# Altium project percepcao_externa_official.PrjPcb
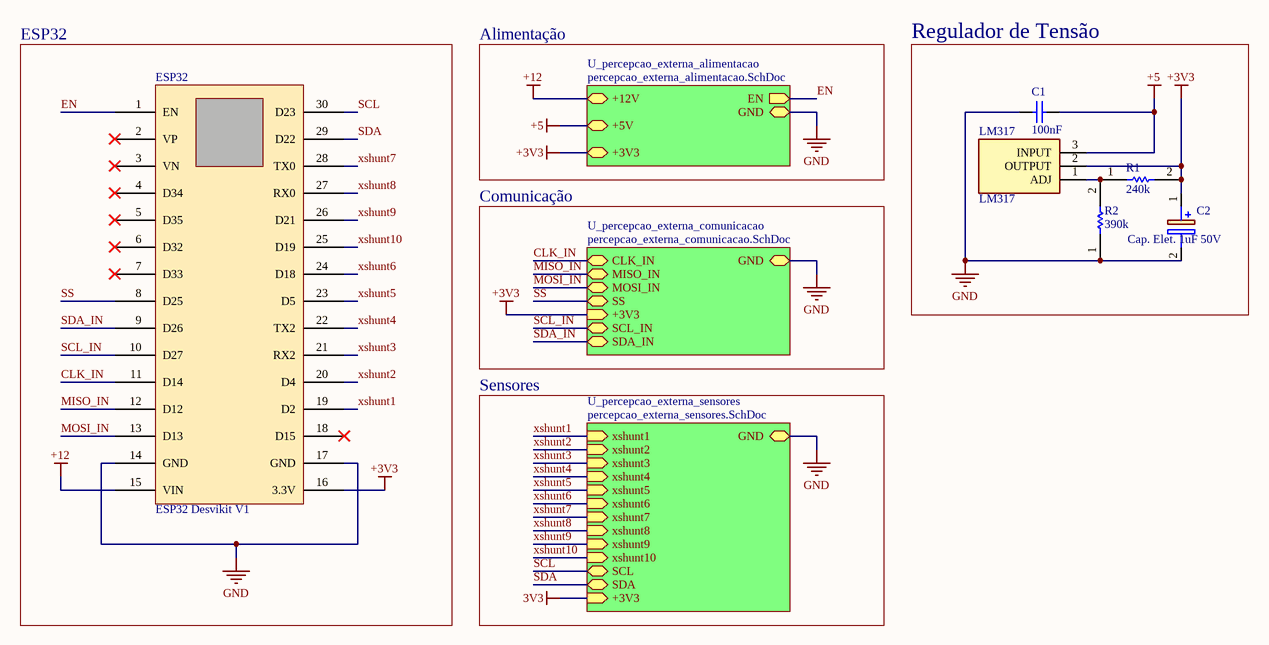
[diagram p0: percepcao_externa_official.SchDoc]
4 sheets, 30 parts. Net scope: hierarchical (ports join the sheet entries above them; power ports are global).
Board file: percepcao_externa_official.PcbDoc
Sheets:
  percepcao_externa_official.SchDoc
    U_percepcao_externa_alimentacao = percepcao_externa_alimentacao.SchDoc
    U_percepcao_externa_sensores = percepcao_externa_sensores.SchDoc
    U_percepcao_externa_comunicacao = percepcao_externa_comunicacao.SchDoc

## Sheet percepcao_externa_official.SchDoc
size A4; SheetNumber: 1; SheetTotal: 4

### Parts
C1  100nF  [CAP CER DISK 10uF 50V]
C2  Cap. Elet. 1uF 50V  [Cap. Elet. 470uF 16V]
ESP32  value ESP32 Desvikit V1  [ESP32_Desvikit_v1]  (hidden comment: microcontrolador)
LM317  LM317  [TO254P467X1016X1971-3P]
R1  240k  [RESC3216X60N]
R2  390k  [RESC3216X60N]

### Blocks framed on the sheet
ESP32: ESP32
Regulador de Tensão: C1 C2 LM317 R1 R2

### Sub-sheets
U_percepcao_externa_alimentacao = percepcao_externa_alimentacao.SchDoc: EN (out), GND (bidir), +12V (bidir), +5V (bidir), +3V3 (bidir)
U_percepcao_externa_comunicacao = percepcao_externa_comunicacao.SchDoc: CLK_IN (bidir), MISO_IN (bidir), MOSI_IN (bidir), SS (bidir), GND (bidir), +3V3 (in), SCL_IN (bidir), SDA_IN (bidir)
U_percepcao_externa_sensores = percepcao_externa_sensores.SchDoc: xshunt1 (in), xshunt2 (in), xshunt3 (in), xshunt4 (in), xshunt5 (in), xshunt6 (in), xshunt7 (in), xshunt8 (in), xshunt9 (in), xshunt10 (in), SCL (bidir), SDA (bidir), GND (bidir), +3V3 (in)

### Nets
3V3: sheet U_percepcao_externa_sensores/+3V3
+3V3: C2.1(+) ESP32.16(3.3V) LM317.2(OUTPUT) R1.2 ; sheet U_percepcao_externa_alimentacao/+3V3, sheet U_percepcao_externa_comunicacao/+3V3
+5: C1.2 LM317.3(INPUT) ; sheet U_percepcao_externa_alimentacao/+5V  [project net +5V]
+12: ESP32.15(VIN) ; sheet U_percepcao_externa_alimentacao/+12V  [project net +12V]
GND: C1.1 C2.2(-) ESP32.14(GND) ESP32.17(GND) R2.1 ; sheet U_percepcao_externa_alimentacao/GND, sheet U_percepcao_externa_sensores/GND, sheet U_percepcao_externa_comunicacao/GND
CLK_IN: ESP32.11(D14) ; sheet U_percepcao_externa_comunicacao/CLK_IN
EN: ESP32.1(EN) ; sheet U_percepcao_externa_alimentacao/EN
MISO_IN: ESP32.12(D12) ; sheet U_percepcao_externa_comunicacao/MISO_IN
MOSI_IN: ESP32.13(D13) ; sheet U_percepcao_externa_comunicacao/MOSI_IN
SCL: ESP32.30(D23) ; sheet U_percepcao_externa_sensores/SCL
SCL_IN: ESP32.10(D27) ; sheet U_percepcao_externa_comunicacao/SCL_IN
SDA: ESP32.29(D22) ; sheet U_percepcao_externa_sensores/SDA
SDA_IN: ESP32.9(D26) ; sheet U_percepcao_externa_comunicacao/SDA_IN
SS: ESP32.8(D25) ; sheet U_percepcao_externa_comunicacao/SS
xshunt1: ESP32.19(D2) ; sheet U_percepcao_externa_sensores/xshunt1
xshunt2: ESP32.20(D4) ; sheet U_percepcao_externa_sensores/xshunt2
xshunt3: ESP32.21(RX2) ; sheet U_percepcao_externa_sensores/xshunt3
xshunt4: ESP32.22(TX2) ; sheet U_percepcao_externa_sensores/xshunt4
xshunt5: ESP32.23(D5) ; sheet U_percepcao_externa_sensores/xshunt5
xshunt6: ESP32.24(D18) ; sheet U_percepcao_externa_sensores/xshunt6
xshunt7: ESP32.28(TX0) ; sheet U_percepcao_externa_sensores/xshunt7
xshunt8: ESP32.27(RX0) ; sheet U_percepcao_externa_sensores/xshunt8
xshunt9: ESP32.26(D21) ; sheet U_percepcao_externa_sensores/xshunt9
xshunt10: ESP32.25(D19) ; sheet U_percepcao_externa_sensores/xshunt10
NetLM317_1: LM317.1(ADJ) R1.1 R2.2

Not connected (* = marked no-connect by the designer): ESP32 2(VP)* 3(VN)* 4(D34)* 5(D35)* 6(D32)* 7(D33)* 18(D15)*

### Notes on the sheet
- Alimentação
- Comunicação
- Sensores

### Library data of the parts
C1 = CAP CER DISK 10uF 50V_1: CAP CER DISK 10uF 50V; Manufacturer Part Number: IMP14925; Product Range: MCFY Series; Capacitance: 0.1uF; Capacitance Tolerance: +80%, -20%; Dielectric Characteristic: Y5; Voltage Rating: 50; Capacitor Terminals: Radial Leaded; SVHC: No SVHC (15-Jun-2015); Supplier 1: Mult Comercial; Manufacturer: -; RoHS: YES; Stock 1: 115809; Pricing 1: 1=0.10 (BRL); Packaging: Each; Lead Spacing: 5; Operating Temperature Min: -25; Operating Temperature Max: 85; Capacitance Tolerance ±: +80%, -20%; Operating Temperature Range: -25°C to +85°C<!--FANDB--><div class="features-and-benefits-container"><div class="features-and-benefits-description"><span class="features-benefits-value">The MCFY series from Multicomp are radial leaded ceramic disc capacitors. The capacitance values ranges from 6800pF to 0.22?F.</span></div><div class="features-and-benefits-list"><ul class="features-and-benefits-list-list"><li class="features-and-benefits-list-item">Large capacitance in small size</li><li class="features-and-benefits-list-item">Rated voltage of 50V</li><li class="features-and-benefits-list-item">80%/-20% tolerance</li><li class="features-and-benefits-list-item">Operating temperature range -25°C to +85; ComponentLink1URL: http://loja.multcomercial.com.br/capacitor-ceramico-disco-100kpf-50v-104-100k-100nf-0-1uf-cod-1351.html; ComponentLink1Description: http://loja.multcomercial.com.br/capacitor-ceramico-disco-100kpf-50v-104-100k-100nf-0-1uf-cod-1351.html; Supplier Part Number 1: Capacitor Cerâmico Disco 100Kpf/50V (104/100K/100nF/0.1uF) cód. 1351
C2 = Cap. Elet. 470 uF 16V: Aluminum Organic Polymer Capacitors 16volts 470uF ESR 10mohm; Manufacturer_Name: Panasonic; Manufacturer_Part_Number: 16SEPC470M; Datasheet Link: http://industrial.panasonic.com/www-cgi/jvcr13pz.cgi?E+CI+4+AAB8010+16SEPC470M+8+WW; Height: 13mm; Mouser Part Number: 667-16SEPC470M; Mouser Price/Stock: https://www.mouser.co.uk/ProductDetail/Panasonic/16SEPC470M?qs=OE1iw1LrrPEdZuWyF2l%252B5w%3D%3D; Arrow Part Number: 16SEPC470M; Arrow Price/Stock: https://www.arrow.com/en/products/16sepc470m/panasonic
ESP32 = ESP32 Desvikit v1: microcontrolador com moculo bluethoth e wifi
LM317 = LM317: Integrated Circuit; Manufacturer_Name: Changjiang Electronics Tech (CJ); Datasheet Link: https://datasheet.lcsc.com/szlcsc/Changjiang-Electronics-Tech-CJ-LM317_C22147.pdf; Height: 4.67mm; Manufacturer_Part_Number: LM317
R1 R2 = RES 1206: RES 1206 5%; Manufacturer_Name: Vishay; Manufacturer_Part_Number: CRCW12064K70FKEA; Datasheet Link: http://docs-emea.rs-online.com/webdocs/13ec/0900766b813ecc08.pdf; Height: 0.6mm; Mouser Part Number: 71-CRCW1206-4.7K-E3; Mouser Price/Stock: https://www.mouser.co.uk/ProductDetail/Vishay-Dale/CRCW12064K70FKEA?qs=1vm4qhDHCvlKJmatsKzyFQ%3D%3D; Arrow Part Number: CRCW12064K70FKEA; Arrow Price/Stock: https://www.arrow.com/en/products/crcw12064k70fkea/vishay

## Sheet percepcao_externa_alimentacao.SchDoc
size A4; SheetNumber: 2; SheetTotal: 4
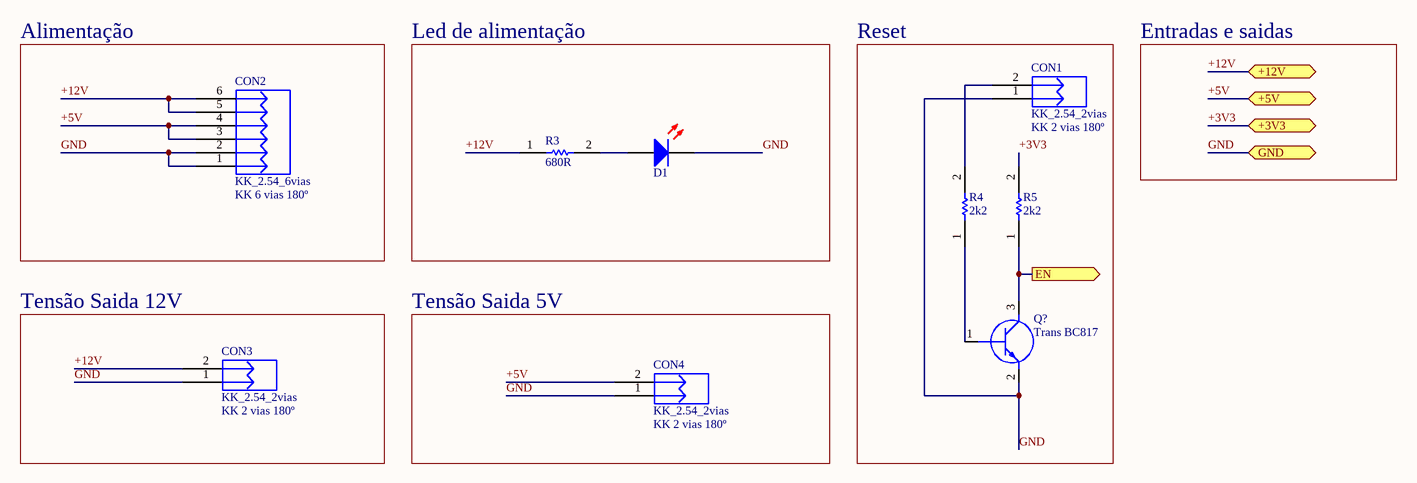
[diagram p1: percepcao_externa_alimentacao.SchDoc]

### Parts
BC817  Trans BC817  [SOT96P240X110-3N]
CON1  KK_2.54_2vias  Valor: KK 2 vias 180º  [KK_2VIAS_180º]
CON2  KK_2.54_6vias  Valor: KK 6 vias 180º  [KK_6vias_180°]
CON3  KK_2.54_2vias  Valor: KK 2 vias 180º  [KK_2VIAS_180º]
CON4  KK_2.54_2vias  Valor: KK 2 vias 180º  [KK_2VIAS_180º]
D1  LED 5MM RED  [LED 5MM RED]  (value not drawn)
R3  680R  [RESC3216X60N]
R4  2k2  [RESC3216X60N]
R5  2k2  [RESC3216X60N]

### Blocks framed on the sheet
Alimentação: CON2
Led de alimentação: D1 R3
Reset: BC817 CON1 R4 R5
Tensão Saida 12V: CON3
Tensão Saida 5V: CON4

### Ports
+3V3 (bidir), +5V (bidir), +12V (bidir), EN (out), GND (bidir)

### Nets
+3V3: R5.2 ; port +3V3
+5V: CON2.3 CON2.4 CON4.2 ; port +5V
+12V: CON2.5 CON2.6 CON3.2 R3.1 ; port +12V
GND: BC817.2(E) CON1.1 CON2.1 CON2.2 CON3.1 CON4.1 D1.2(K) ; port GND
EN: BC817.3(C) R5.1 ; port EN
NetBC817_1: BC817.1(B) R4.1
NetCON1_2: CON1.2 R4.2
NetD1_1: D1.1(A) R3.2

### Notes on the sheet
- Entradas e saidas

### Library data of the parts
BC817 = Trans BC817: Transistor BJT NPN BC817-25-7-F; Manufacturer_Name: Diodes Inc.
CON1 CON3 CON4 = KK_2.54_2vias: Conector KK 2.54mm 2 vias; Descrição: Conector KK 3 vias com passo 2.54mm; Encapsulamento: PTH - 180º; Modelo: 2 vias - 180º; Marca: *; Observação: *
CON2 = KK_2.54_6vias: Conector KK 2.54mm 6 vias; Descrição: Conector KK 3 vias com passo 2.54mm; Encapsulamento: PTH - 180º; Modelo: 3 vias - 180º; Marca: *; Observação: *
D1 = LED 5MM RED: Manufacturer: Paralight; Manufacturer Part Number: IMP585; Bulb Size: 3mm; Wavelength Typ: 625; Forward Voltage: 2; Forward Current If: 20; Luminous Intensity: 3; LED Mounting: Through Hole; Lens Shape: Round; Viewing Angle: 60°; SVHC: No SVHC (15-Jun-2015); External Diameter: 2.9; External Length / Height: 4.6; Forward Voltage VF Max: 2.5; LED / Lamp Size: 3mm / T-1; LED Type: Standard; Lead Cross-section Depth: 0.5; Luminous Intensity @ If Min: 0.7; PIV Max: 5; Peak Forward Current: 7; Voltage Vf Typ: 2.2V<!--FANDB--><div class="features-and-benefits-container"><div class="features-and-benefits-description"><span class="features-benefits-value">The L-934LID from Kingbright is a through hole round shape high efficiency red colour LED. The device is made of gallium arsenide phosphide on gallium phosphide orange light emitting diode. This LED is widely used because of low power consumption, long life and solid state reliability.</span></div><div class="features-and-benefits-list"><ul class="features-and-benefits-list-list"><li class="features-and-benefits-list-item">Standard bulb size of T-1 (3mm)</li><li class="features-and-benefits-list-item">Reliable and rugged</li><li class="features-and-benefits-list-item">Viewing angle is 60°</li><li class="features-and-benefits-list-item">Luminous intensity of 3mcd at 2mA</li><li class="features-and-benefits-list-item">Forward voltage is 2.0V</li><li class="features-and-benefits-list-item">Forward current (If) is 20mA</li><li class="features-and-benefits-list-item">Dominant wavelength is 625nm at IF=20mA</li><li class="features-and-benefits-list-item">Peak wavelength is 627nm at IF=20; Supplier 1: Mult Comercial; RoHS: YES; Stock 1: 35260; Pricing 1: 1=0.15 (BRL); LED Colour: Red; Packaging: Each; MSL: -; Current If Luminous Intensity: 2; Dominant Wavelength: 625; Forward Current If Max: 20; Lead Cross-section Width: 0.5; Lead Spacing: 2.54; Luminous Intensity Typ: 3; Mounting Type: PCB Through Hole; No. of Pins: 2; Operating Temperature Max: 85; Operating Temperature Min: -40; Operating Temperature Range: -40°C to +85; Peak Wavelength: 625; ComponentLink1URL: http://loja.multcomercial.com.br/led-3mm-vermelho-difuso-l-314hd-paralight.html; ComponentLink1Description: http://loja.multcomercial.com.br/led-3mm-vermelho-difuso-l-314hd-paralight.html; Supplier Part Number 1: Led 3mm Vermelho Difuso L-314HD - Paralight
R3-R5 = Resistor 1206: Resistor; Manufacturer_Name: Vishay; Manufacturer_Part_Number: CRCW12064K70FKEA; Datasheet Link: http://docs-emea.rs-online.com/webdocs/13ec/0900766b813ecc08.pdf; Height: 0.6mm; Mouser Part Number: 71-CRCW1206-4.7K-E3; Mouser Price/Stock: https://www.mouser.co.uk/ProductDetail/Vishay-Dale/CRCW12064K70FKEA?qs=1vm4qhDHCvlKJmatsKzyFQ%3D%3D; Arrow Part Number: CRCW12064K70FKEA; Arrow Price/Stock: https://www.arrow.com/en/products/crcw12064k70fkea/vishay

## Sheet percepcao_externa_sensores.SchDoc
size A4; SheetNumber: 4; SheetTotal: 4
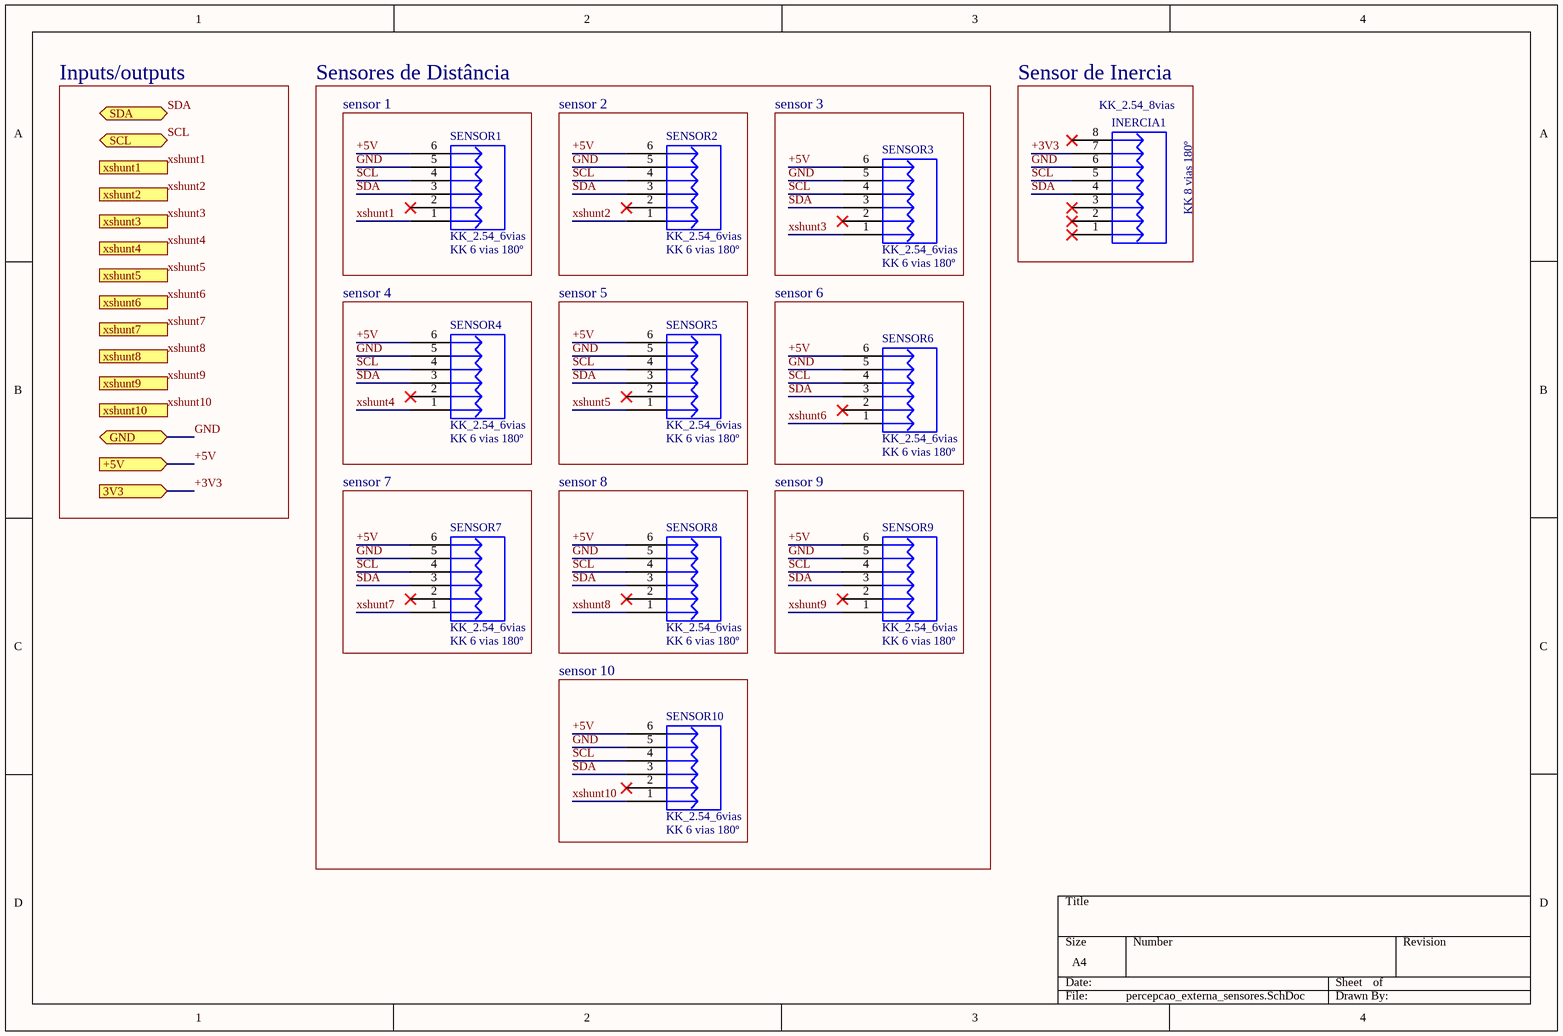
[diagram p2: percepcao_externa_sensores.SchDoc]

### Parts
INERCIA1  KK_2.54_8vias  Valor: KK 8 vias 180º  [KK_8vias_180°]
SENSOR1  KK_2.54_6vias  Valor: KK 6 vias 180º  [KK_6vias_180°]
SENSOR2  KK_2.54_6vias  Valor: KK 6 vias 180º  [KK_6vias_180°]
SENSOR3  KK_2.54_6vias  Valor: KK 6 vias 180º  [KK_6vias_180°]
SENSOR4  KK_2.54_6vias  Valor: KK 6 vias 180º  [KK_6vias_180°]
SENSOR5  KK_2.54_6vias  Valor: KK 6 vias 180º  [KK_6vias_180°]
SENSOR6  KK_2.54_6vias  Valor: KK 6 vias 180º  [KK_6vias_180°]
SENSOR7  KK_2.54_6vias  Valor: KK 6 vias 180º  [KK_6vias_180°]
SENSOR8  KK_2.54_6vias  Valor: KK 6 vias 180º  [KK_6vias_180°]
SENSOR9  KK_2.54_6vias  Valor: KK 6 vias 180º  [KK_6vias_180°]
SENSOR10  KK_2.54_6vias  Valor: KK 6 vias 180º  [KK_6vias_180°]

### Blocks framed on the sheet
Sensor de Inercia: INERCIA1
sensor 1: SENSOR1
sensor 2: SENSOR2
sensor 3: SENSOR3
sensor 4: SENSOR4
sensor 5: SENSOR5
sensor 6: SENSOR6
sensor 7: SENSOR7
sensor 8: SENSOR8
sensor 9: SENSOR9
sensor 10: SENSOR10

### Ports
3V3 (in), +5V (in), GND (bidir), SCL (bidir), SDA (bidir), xshunt1 (in), xshunt2 (in), xshunt3 (in), xshunt4 (in), xshunt5 (in), xshunt6 (in), xshunt7 (in), xshunt8 (in), xshunt9 (in), xshunt10 (in)

### Nets
GND: INERCIA1.6 SENSOR1.5 SENSOR2.5 SENSOR3.5 SENSOR4.5 SENSOR5.5 SENSOR6.5 SENSOR7.5 SENSOR8.5 SENSOR9.5 SENSOR10.5 ; port GND
+3V3: INERCIA1.7 ; port 3V3
+5V: SENSOR1.6 SENSOR2.6 SENSOR3.6 SENSOR4.6 SENSOR5.6 SENSOR6.6 SENSOR7.6 SENSOR8.6 SENSOR9.6 SENSOR10.6 ; port +5V
SCL: INERCIA1.5 SENSOR1.4 SENSOR2.4 SENSOR3.4 SENSOR4.4 SENSOR5.4 SENSOR6.4 SENSOR7.4 SENSOR8.4 SENSOR9.4 SENSOR10.4 ; port SCL
SDA: INERCIA1.4 SENSOR1.3 SENSOR2.3 SENSOR3.3 SENSOR4.3 SENSOR5.3 SENSOR6.3 SENSOR7.3 SENSOR8.3 SENSOR9.3 SENSOR10.3 ; port SDA
xshunt1: SENSOR1.1 ; port xshunt1
xshunt2: SENSOR2.1 ; port xshunt2
xshunt3: SENSOR3.1 ; port xshunt3
xshunt4: SENSOR4.1 ; port xshunt4
xshunt5: SENSOR5.1 ; port xshunt5
xshunt6: SENSOR6.1 ; port xshunt6
xshunt7: SENSOR7.1 ; port xshunt7
xshunt8: SENSOR8.1 ; port xshunt8
xshunt9: SENSOR9.1 ; port xshunt9
xshunt10: SENSOR10.1 ; port xshunt10

Not connected (* = marked no-connect by the designer): INERCIA1 1* 2* 3* 8*; SENSOR1 2*; SENSOR2 2*; SENSOR3 2*; SENSOR4 2*; SENSOR5 2*; SENSOR6 2*; SENSOR7 2*; SENSOR8 2*; SENSOR9 2*; SENSOR10 2*

### Notes on the sheet
- Inputs/outputs
- Sensores de Distância

### Library data of the parts
INERCIA1 = KK_2.54_8vias: Conector KK 2.54mm 8 vias; Descrição: Conector KK 3 vias com passo 2.54mm; Encapsulamento: PTH - 180º; Modelo: 3 vias - 180º; Marca: *; Observação: *
SENSOR1-SENSOR10 = KK_2.54_6vias: as CON2 on sheet percepcao_externa_alimentacao; Marca: *; Observação: *

## Sheet percepcao_externa_comunicacao.SchDoc
size A4; SheetNumber: 4; SheetTotal: 4
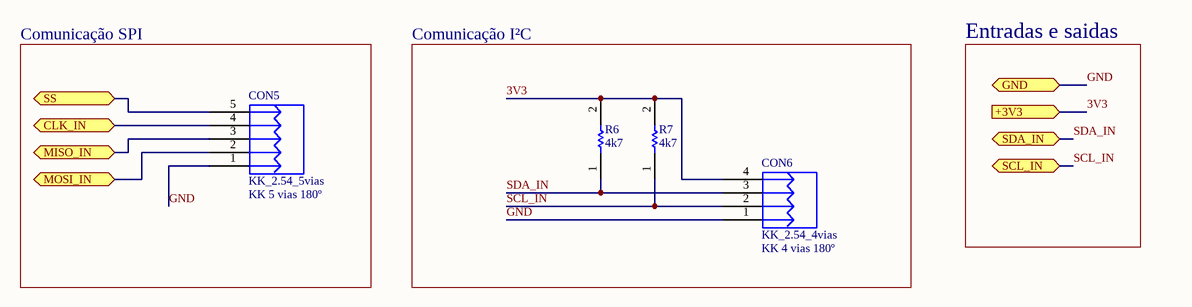
[diagram p3: percepcao_externa_comunicacao.SchDoc]

### Parts
CON5  KK_2.54_5vias  Valor: KK 5 vias 180º  [KK_5vias_180°]
CON6  KK_2.54_4vias  Valor: KK 4 vias 180º  [KK_4vias_180°]
R6  4k7  [RESC3216X60N]
R7  4k7  [RESC3216X60N]

### Blocks framed on the sheet
Comunicação SPI: CON5
Comunicação I²C: CON6 R6 R7

### Ports
+3V3 (in), CLK_IN (bidir), GND (bidir), MISO_IN (bidir), MOSI_IN (bidir), SCL_IN (bidir), SDA_IN (bidir), SS (bidir)

### Nets
3V3: CON6.4 R6.2 R7.2 ; port +3V3  [project net +3V3]
GND: CON5.1 CON6.1 ; port GND
CLK_IN: CON5.4 ; port CLK_IN
MISO_IN: CON5.3 ; port MISO_IN
MOSI_IN: CON5.2 ; port MOSI_IN
SCL_IN: CON6.2 R7.1 ; port SCL_IN
SDA_IN: CON6.3 R6.1 ; port SDA_IN
SS: CON5.5 ; port SS

### Notes on the sheet
- Entradas e saidas

### Library data of the parts
CON5 = KK_2.54_5vias: Conector KK 2.54mm 5 vias; Descrição: Conector KK 3 vias com passo 2.54mm; Encapsulamento: PTH - 180º; Modelo: 3 vias - 180º; Marca: *; Observação: *
CON6 = KK_2.54_4vias: Conector KK 2.54mm 4 vias; Descrição: Conector KK 3 vias com passo 2.54mm; Encapsulamento: PTH - 180º; Modelo: 3 vias - 180º; Marca: *; Observação: *
R6 R7 = RES 1206: as R1 on sheet percepcao_externa_official; Datasheet Link: http://docs-emea.rs-online.com/webdocs/13ec/0900766b813ecc08.pdf; Height: 0.6mm; Mouser Part Number: 71-CRCW1206-4.7K-E3; Mouser Price/Stock: https://www.mouser.co.uk/ProductDetail/Vishay-Dale/CRCW12064K70FKEA?qs=1vm4qhDHCvlKJmatsKzyFQ%3D%3D; Arrow Part Number: CRCW12064K70FKEA; Arrow Price/Stock: https://www.arrow.com/en/products/crcw12064k70fkea/vishay

## Nets that join several sheets
+3V3: percepcao_externa_official (C2.1 ESP32.16 LM317.2 R1.2), percepcao_externa_alimentacao (R5.2), percepcao_externa_comunicacao (CON6.4 R6.2 R7.2)
+5V: percepcao_externa_official (C1.2 LM317.3), percepcao_externa_alimentacao (CON2.3 CON2.4 CON4.2)
+12V: percepcao_externa_official (ESP32.15), percepcao_externa_alimentacao (CON2.5 CON2.6 CON3.2 R3.1)
GND: percepcao_externa_official (5 pins), percepcao_externa_alimentacao (7 pins), percepcao_externa_sensores (11 pins), percepcao_externa_comunicacao (CON5.1 CON6.1)
CLK_IN: percepcao_externa_official (ESP32.11), percepcao_externa_comunicacao (CON5.4)
EN: percepcao_externa_official (ESP32.1), percepcao_externa_alimentacao (BC817.3 R5.1)
MISO_IN: percepcao_externa_official (ESP32.12), percepcao_externa_comunicacao (CON5.3)
MOSI_IN: percepcao_externa_official (ESP32.13), percepcao_externa_comunicacao (CON5.2)
SCL: percepcao_externa_official (ESP32.30), percepcao_externa_sensores (11 pins)
SCL_IN: percepcao_externa_official (ESP32.10), percepcao_externa_comunicacao (CON6.2 R7.1)
SDA: percepcao_externa_official (ESP32.29), percepcao_externa_sensores (11 pins)
SDA_IN: percepcao_externa_official (ESP32.9), percepcao_externa_comunicacao (CON6.3 R6.1)
SS: percepcao_externa_official (ESP32.8), percepcao_externa_comunicacao (CON5.5)
xshunt1: percepcao_externa_official (ESP32.19), percepcao_externa_sensores (SENSOR1.1)
xshunt2: percepcao_externa_official (ESP32.20), percepcao_externa_sensores (SENSOR2.1)
xshunt3: percepcao_externa_official (ESP32.21), percepcao_externa_sensores (SENSOR3.1)
xshunt4: percepcao_externa_official (ESP32.22), percepcao_externa_sensores (SENSOR4.1)
xshunt5: percepcao_externa_official (ESP32.23), percepcao_externa_sensores (SENSOR5.1)
xshunt6: percepcao_externa_official (ESP32.24), percepcao_externa_sensores (SENSOR6.1)
xshunt7: percepcao_externa_official (ESP32.28), percepcao_externa_sensores (SENSOR7.1)
xshunt8: percepcao_externa_official (ESP32.27), percepcao_externa_sensores (SENSOR8.1)
xshunt9: percepcao_externa_official (ESP32.26), percepcao_externa_sensores (SENSOR9.1)
xshunt10: percepcao_externa_official (ESP32.25), percepcao_externa_sensores (SENSOR10.1)